# Altium schematic sheet Power.SchDoc
size A
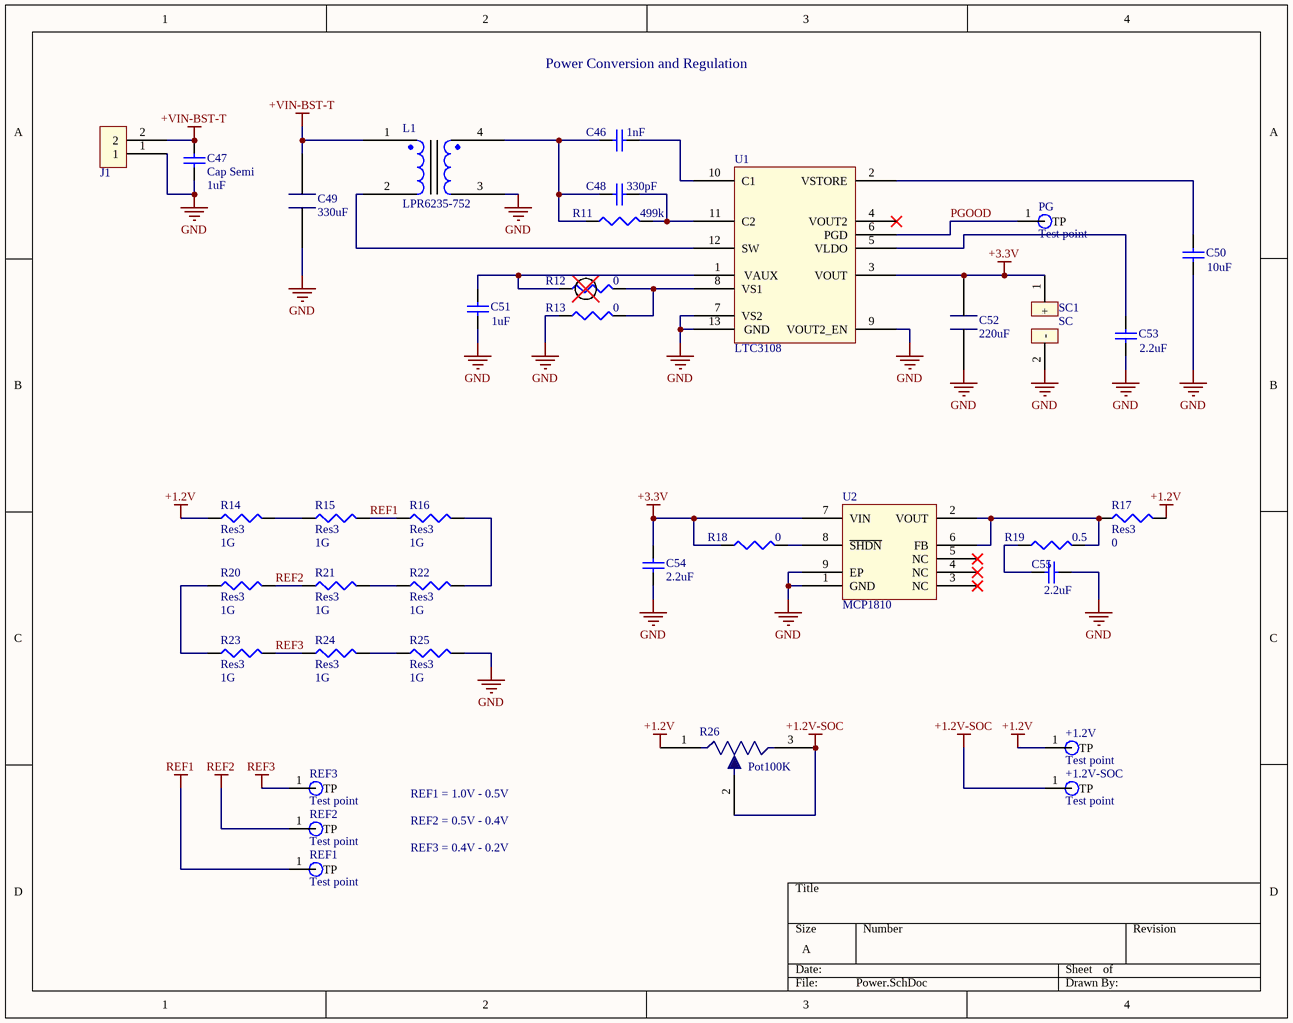
[diagram p0: Power.SchDoc]

## Parts
+1.2V  Test point  [TP]
+1.2V-SOC  Test point  [TP]
C46  value 1nF  [0402]  (hidden comment: Cap Semi)
C47  Cap Semi  value 1uF  [0402]
C48  value 330pF  [0402]  (hidden comment: Cap Semi)
C49  330uF  [CAPCP7343X43NEW]
C50  value 10uF  [0402]  (hidden comment: Cap Semi)
C51  value 1uF  [0402]  (hidden comment: Cap Semi)
C52  220uF  [CAPCP7343X43NEW]
C53  value 2.2uF  [0402]  (hidden comment: Cap Semi)
C54  value 2.2uF  [0402]  (hidden comment: Cap Semi)
C55  value 2.2uF  [0402]  (hidden comment: Cap Semi)
J1  MolexPicoLock  [5037630291_MolexPicoLock]  (value not drawn)
L1  LPR6235-752  [LPR6235-752]
PG  Test point  [TP]
R11  value 499k  [0402]  (hidden comment: Res3)
R12  value 0  [0402]  (hidden comment: Res3)
R13  value 0  [0402]  (hidden comment: Res3)
R14  Res3  value 1G  [6-0805_N]
R15  Res3  value 1G  [6-0805_N]
R16  Res3  value 1G  [6-0805_N]
R17  Res3  value 0  [0402]
R18  value 0  [0402]  (hidden comment: Res3)
R19  value 0.5  [0402]  (hidden comment: Res3)
R20  Res3  value 1G  [6-0805_N]
R21  Res3  value 1G  [6-0805_N]
R22  Res3  value 1G  [6-0805_N]
R23  Res3  value 1G  [6-0805_N]
R24  Res3  value 1G  [6-0805_N]
R25  Res3  value 1G  [6-0805_N]
R26  Pot100K  [Pot100K]
REF1  Test point  [TP]
REF2  Test point  [TP]
REF3  Test point  [TP]
SC1  SC  [SocketBattCR2032]
U1  LTC3108  [QFN0P300X400X80_HS-13M]
U2  MCP1810  [MCP1810]

## Nets
+1.2V: +1.2V.1(TP) R14.1 R17.2 R26.1
+1.2V-SOC: +1.2V-SOC.1(TP) R26.2 R26.3
+3.3V: C52.1 C54.2 R18.1 SC1.1(+) U1.3(VOUT) U2.7(VIN)
+VIN-BST-T: C47.1 C49.1 J1.2 L1.1
GND: C47.2 C49.2 C50.1 C51.1 C52.2 C53.1 C54.1 C55.1 J1.1 L1.3 R13.1 R25.2 SC1.2(-) U1.7(VS2) U1.9(VOUT2_EN) U1.13(GND) U2.1(GND) U2.9(EP)
REF1: R15.2 R16.1 REF1.1(TP)
REF2: R20.2 R21.1 REF2.1(TP)
REF3: R23.2 R24.1 REF3.1(TP)
PGOOD: PG.1(TP) U1.6(PGD)
NetC46_1: C46.1 C48.1 L1.4 R11.1
NetC46_2: C46.2 U1.10(C1)
NetC48_2: C48.2 R11.2 U1.11(C2)
NetC50_2: C50.2 U1.2(VSTORE)
NetC51_2: C51.2 R12.1 U1.1(VAUX)
NetC53_2: C53.2 U1.5(VLDO)
NetC55_2: C55.2 R19.1
NetL1_2: L1.2 U1.12(SW)
NetR12_2: R12.2 R13.2 U1.8(VS1)
NetR14_2: R14.2 R15.1
NetR16_2: R16.2 R22.2
NetR17_1: R17.1 R19.2 U2.2(VOUT) U2.6(FB)
NetR18_2: R18.2 U2.8(~{SHDN})
NetR20_1: R20.1 R23.1
NetR21_2: R21.2 R22.1
NetR24_2: R24.2 R25.1

Not connected (* = marked no-connect by the designer): U1 4(VOUT2)*; U2 3(NC)* 4(NC)* 5(NC)*

## Notes on the sheet
- Power Conversion and Regulation
- REF1 = 1.0V - 0.5V
- REF2 = 0.5V - 0.4V
- REF3 = 0.4V - 0.2V

## Library data of the parts
C46-C48 C50 C51 C53-C55 = Cap Semi: Capacitor (Semiconductor SIM Model); Published: 8-Jun-2000; LatestRevisionDate: 29-May-2009; LatestRevisionNote: IPC-7351 Footprint Added.; PackageReference: C1206; Publisher: Altium Limited; PackageDescription: Chip Capacitor
C49 C52 = BoostCap
J1 = MolexPicoLock: Molex Pico Lock 2 pin
R11-R25 = Res3: Resistor; Published: 8-Jun-2000; LatestRevisionDate: 29-May-2009; LatestRevisionNote: IPC-7351 Footprint Added.; PackageReference: J1-0603; Publisher: Altium Limited; PackageDescription: Chip Resistor
R26 = Pot100K: EVM-2WSX80B15 100K Trimpot SMD
SC1 = Soket Battery CR2032: Socket Battery CR2032
U2 = MCP1810: Ultra-low Power LDO